# EAGLE design Qwiic Power Switch (EAGLE 9.6.0)
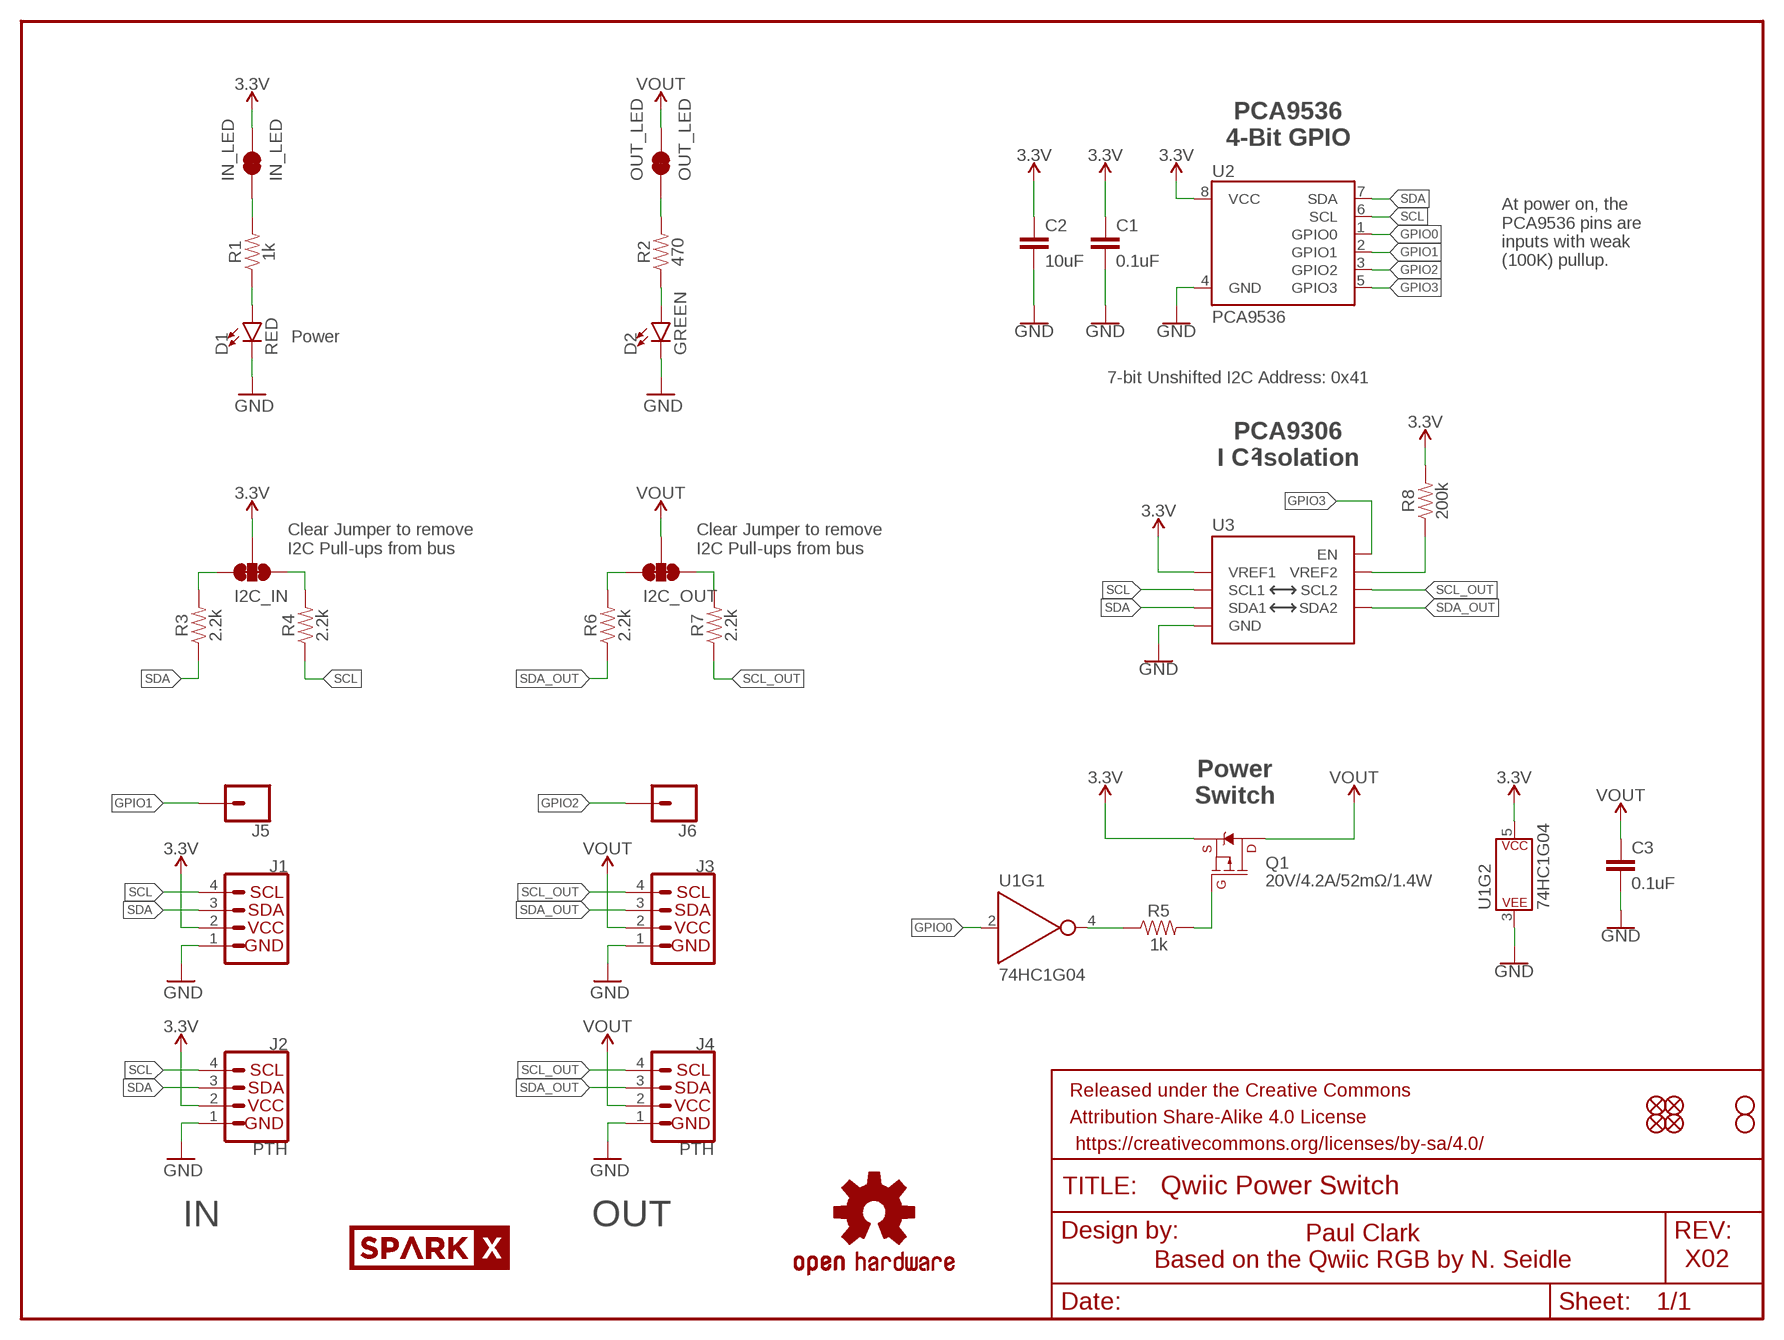
[diagram p0: schematic, sheet 1]

## Parts
C1  0.1uF  0.1UF-0603-25V-(+80/-20%)  [0603]
C2  10uF  10UF-0603-6.3V-20%  [0603]
C3  0.1uF  0.1UF-0603-25V-(+80/-20%)  [0603]
D1  RED  LED-RED0603  [LED-0603]
D2  GREEN  LED-GREEN0603  [LED-0603]
FRAME1  FRAME-LETTER  [CREATIVE_COMMONS]
I2C_IN  JUMPER-SMT_3_2-NC_TRACE_SILK  [SMT-JUMPER_3_2-NC_TRACE_SILK]
I2C_OUT  JUMPER-SMT_3_2-NC_TRACE_SILK  [SMT-JUMPER_3_2-NC_TRACE_SILK]
IN_LED  IN_LED  JUMPER-SMT_2_NC_TRACE_SILK  [SMT-JUMPER_2_NC_TRACE_SILK]
J1  Qwiic Right Angle  I2C_STANDARDQWIIC  [JST04_1MM_RA]
J2  PTH  I2C_STANDARD_NO_SILK  [1X04_NO_SILK]
J3  Qwiic Right Angle  I2C_STANDARDQWIIC  [JST04_1MM_RA]
J4  PTH  I2C_STANDARD_NO_SILK  [1X04_NO_SILK]
J5  CONN_01PTH_NO_SILK_YES_STOP  [1X01_NO_SILK]
J6  CONN_01PTH_NO_SILK_YES_STOP  [1X01_NO_SILK]
JP1  FIDUCIAL1X2  [FIDUCIAL-1X2]
JP2  FIDUCIAL1X2  [FIDUCIAL-1X2]
JP3  STAND-OFF  [STAND-OFF]
JP4  STAND-OFF  [STAND-OFF]
JP5  FIDUCIAL1X2  [FIDUCIAL-1X2]
JP6  FIDUCIAL1X2  [FIDUCIAL-1X2]
LOGO1  OSHW-LOGOMINI  [OSHW-LOGO-MINI]
OUT_LED  OUT_LED  JUMPER-SMT_2_NC_TRACE_SILK  [SMT-JUMPER_2_NC_TRACE_SILK]
Q1  20V/4.2A/52mΩ/1.4W  MOSFET_PCH-DMG2305UX-7  [SOT23-3]
R1  1k  1KOHM-0603-1/10W-1%  [0603]
R2  470  470OHM-0603-1/10W-1%  [0603]
R3  2.2k  2.2KOHM-0603-1/10W-1%  [0603]
R4  2.2k  2.2KOHM-0603-1/10W-1%  [0603]
R5  1k  1KOHM-0603-1/10W-1%  [0603]
R6  2.2k  2.2KOHM-0603-1/10W-1%  [0603]
R7  2.2k  2.2KOHM-0603-1/10W-1%  [0603]
R8  200k  200KOHM-0603-1/10W-1%  [0603]
U1  74HC1G04  [SOT353]
U2  PCA9536  [MSOP8]
U3  PCA9306VSSOP_8PIN  [VSSOP_8PIN]
U$2  SPARKX-LOGO4  [SPARKX-MEDIUM]

## Nets
3.3V: C1.1 C2.1 I2C_IN.2 IN_LED.2 J1.2 J2.2 Q1.2(S) R8.2 U1.5(P$V+) U2.8(VCC) U3.P2(VREF1)
GND: C1.2 C2.2 C3.2 D1.C D2.C J1.1 J2.1 J3.1 J4.1 U1.3(P$V-) U2.4(GND) U3.P1(GND)
GPIO0: U1.2(A) U2.1(GPIO0)
GPIO1: J5.1 U2.2(GPIO1)
GPIO2: J6.1 U2.3(GPIO2)
GPIO3: U2.5(GPIO3) U3.P8(EN)
N$1: I2C_IN.1 R4.2
N$2: I2C_IN.3 R3.2
N$3: D1.A R1.1
N$4: IN_LED.1 R1.2
N$5: R5.1 U1.4(Y)
N$6: Q1.1(G) R5.2
N$7: OUT_LED.1 R2.2
N$8: I2C_OUT.1 R7.2
N$9: D2.A R2.1
N$10: I2C_OUT.3 R6.2
N$12: R8.1 U3.P7(VREF2)
SCL: J1.4 J2.4 R4.1 U2.6(SCL) U3.P3(SCL1)
SCL_OUT: J3.4 J4.4 R7.1 U3.P6(SCL2)
SDA: J1.3 J2.3 R3.1 U2.7(SDA) U3.P4(SDA1)
SDA_OUT: J3.3 J4.3 R6.1 U3.P5(SDA2)
VOUT: C3.1 I2C_OUT.2 J3.2 J4.2 OUT_LED.2 Q1.3(D)

## Notes on the sheet
- PCA9536
  4-Bit GPIO
- At power on, the
  PCA9536 pins are
  inputs with weak
  (100K) pullup.
- Power
- 7-bit Unshifted I2C Address: 0x41
- PCA9306
  I C Isolation
- 2
- Clear Jumper to remove
  I2C Pull-ups from bus
- Clear Jumper to remove
  I2C Pull-ups from bus
- Power
  Switch
- IN | OUT
- Paul Clark
  Based on the Qwiic RGB by N. Seidle
- X02

## Library data of the parts
C1 C3 = SparkFun-Capacitors:0.1UF: 0.1µF ceramic capacitors A capacitor is a passive two-terminal electrical component used to store electrical energy temporarily in an electric field.; PROD_ID: CAP-00810
C2 = SparkFun-Capacitors:10UF: 10.0µF ceramic capacitors A capacitor is a passive two-terminal electrical component used to store electrical energy temporarily in an electric field.; PROD_ID: CAP-11015
D1 = SparkFun-LED:LED-RED: Red SMD LED Used in manufacturing of most products at SparkFun Packages: 0603 - SMD 0603 package [Product Link] <http://docs.avagotech.com/docs/AV02-0551EN> 0603 SMART - SMD 0603 SMART package ( more efficient and expensive)[Product Link] <http://www.osram-os.com/Graphics/XPic2/00077099_0.pdf> 1206 - SMD1206 package [Product Link] <https://www.sparkfun.com/datasheets/DevTools/LilyPad/Q150OVS4.pdff> SparkFun Products: Pro Mini 328 -5V <https://www.sparkfun.com/products/821> RedBoard <https://www.sparkfun.com/products/12757> IOIO-OTG <https://www.sparkfun.com/products/13613>; PROD_ID: DIO-00819
D2 = SparkFun-LED:LED-GREEN: Green SMD LED Used in manufacturing of various products at SparkFun Packages: 0603 - SMD 0603 package [Product Link] <http://www.futureelectronics.com/en/technologies/semiconductors/optoelectronics/leds/Pages/9894312-LTST-C190GKT.aspx?CrossPart=HSMG-C190&IM=0> LilyPad 1206 - SMD1206 LilyPad package [Product Link] <http://www.futureelectronics.com/en/Technologies/Product.aspx?ProductID=IN150NGHARVATEKCORPORATION2049943&IM=0> 1206 - SMD1206 package [Product Link] <http://www.futureelectronics.com/en/technologies/semiconductors/optoelectronics/leds/Pages/8315665-LTST-C150KGKT.aspx?IM=0> 1206 Bottom Mount -SMD 1206 Bottom Mount [Product Link] <http://www.digikey.com/product-detail/en/lite-on-inc/LTST-C230KGKT/160-1456-1-ND/386854> SparkFun Products: Pro Mini 328 -5V <https://www.sparkfun.com/products/821> RedBoard <https://www.sparkfun.com/products/12757> MP3 Trigger <https://www.sparkfun.com/products/13720> Makey Makey <https://www.sparkfun.com/products/11076>; PROD_ID: DIO-00821
FRAME1 = SparkFun-Aesthetics:FRAME-LETTER: Schematic Frame - Letter Standard 8.5x11 US Letter frame
I2C_IN I2C_OUT = SparkFun-Jumpers:JUMPER-SMT_3_2-NC_TRACE: Normally closed trace jumper (2 of 2 connections) This jumper has a trace between all three pads so they are normally closed (NC). Use a razor knife to open the connection(s). For best results follow the IPC guidelines for cutting traces: Cutout at least 0.063 mm (0.005 in). Remove all loose material to clean up the cut area. Seal the cut with an approved epoxy. Reapply solder to reclose the connection(s).
IN_LED OUT_LED = SparkFun-Jumpers:JUMPER-SMT_2_NC_TRACE: Normally closed trace jumper This jumper has a trace between two pads so it's normally closed (NC). Use a razor knife to open the connection. For best results follow the IPC guidelines for cutting traces: Cutout at least 0.063 mm (0.005 in). Remove all loose material to clean up the cut area. Seal the cut with an approved epoxy. Reapply solder to reclose the connection.
J1 J3 = SparkFun-Connectors:I2C_STANDARD: SparkFun I2C Standard Pinout Header SparkFun has standardized on a pinout for all I2C based sensor breakouts. This pinout allows I2C boards to be plugged directly into the headers on Arduino Uno compatible boards, and to be daisy chained easily. Example SparkFun Products: SparkFun Atmospheric Sensor Breakout - BME280 <https://www.sparkfun.com/products/13676> SparkFun Altitude/Pressure Sensor Breakout - MPL3115A2 <https://www.sparkfun.com/products/11084> SparkFun TOF Range Finder Sensor - VL6180 <https://www.sparkfun.com/products/12785>; PROD_ID: CONN-13694
J2 J4 = SparkFun-Connectors:I2C_STANDARD: SparkFun I2C Standard Pinout Header SparkFun has standardized on a pinout for all I2C based sensor breakouts. This pinout allows I2C boards to be plugged directly into the headers on Arduino Uno compatible boards, and to be daisy chained easily. Example SparkFun Products: SparkFun Atmospheric Sensor Breakout - BME280 <https://www.sparkfun.com/products/13676> SparkFun Altitude/Pressure Sensor Breakout - MPL3115A2 <https://www.sparkfun.com/products/11084> SparkFun TOF Range Finder Sensor - VL6180 <https://www.sparkfun.com/products/12785>
J5 J6 = SparkFun-Connectors:CONN_01: Single connection point. Often used as Generic Header-pin footprint for 0.1 inch spaced/style header connections On any of the 0.1 inch spaced packages, you can populate with these: Break Away Headers - Straight <https://www.sparkfun.com/products/116> (PRT-00116) Break Away Male Headers - Right Angle <https://www.sparkfun.com/products/553> (PRT-00553) Female Headers <https://www.sparkfun.com/products/115> (PRT-00115) Break Away Headers - Machine Pin <https://www.sparkfun.com/products/117> (PRT-00117) Break Away Female Headers - Swiss Machine Pin <https://www.sparkfun.com/products/743> (PRT-00743) This device is also useful as a general connection point to wire up your design to another part of your project. Our various solder wires solder well into these plated through hole pads. Hook-Up Wire - Assortment (Stranded, 22 AWG) <https://www.sparkfun.com/products/11375> (PRT-11375) Hook-Up Wire - Assortment (Solid Core, 22 AWG) <https://www.sparkfun.com/products/11367> (PRT-11367) View the entire wire category on our website here <https://www.sparkfun.com/categories/141> Special notes: SMTSO-256-ET is a "flush mount" nut for a 4-40 screw. We mostly use this on specialty testbeds; it is a nice way to connect hardware to your PCB at an adjustable hieght. Also note, the SNAP packages are for using a snappable style connector. We sell a baggie of snaps and they are also used on two LilyPad designs: Snap Assortment - 30 pack (male and female) <https://www.sparkfun.com/products/11347> (DEV-11347) LilyPad Arduino SimpleSnap <https://www.sparkfun.com/products/10941> (DEV-10941) LilyPad SimpleSnap Protoboard <https://www.sparkfun.com/products/10940> (DEV-10940)
JP1 JP2 JP5 JP6 = SparkFun-Aesthetics:FIDUCIAL: Fiducial Alignment Points Point-of-reference for pick-and-place machines and other optical instruments.
JP3 JP4 = SparkFun-Hardware:STAND-OFF: Stand Off Drill holes for mechanically mounting via screws, standoffs, etc. Note: Use the keepout ring to avoid running the screw head into surrounding components. Variant Overviews STAND-OFF - Mechanical footprint for a #4 phillips button head screw. STAND-OFF-TIGHT - Mechanical footprint for a #4 phillips button head screw, Example SparkFun Products Screw - Phillips Head (1/4", 4-40, 10 pack) <https://www.sparkfun.com/products/10453> (PRT-10453) Screw - Phillips Head (1/2", 4-40, 10 pack) <https://www.sparkfun.com/products/10452> (PRT-10452) Screw - Phillips Head (3/4", 4-40, 10 pack) <https://www.sparkfun.com/products/10451> (PRT-10451) Screw - Phillips Head (1", 4-40, 10 pack) <https://www.sparkfun.com/products/10450> (PRT-10450)
LOGO1 = SparkFun-Aesthetics:OSHW-LOGO: Open-Source Hardware (OSHW) Logo This logo indicates the piece of hardware it is found on incorporates a OSHW license and/or adheres to the definition of open source hardware found here: http://freedomdefined.org/OSHW
Q1 = SparkFun-DiscreteSemi:MOSFET_PCH: P-channel MOSFETs Voltage controlled devices that allow control of high current outputs. SparkFun Products: SparkFun ESP32 Thing <https://www.sparkfun.com/products/13907> SparkFun ESP8266 Thing <https://www.sparkfun.com/products/13231> SparkFun Pi Servo HAT V2 <https://www.sparkfun.com/products/15316> DMG2305UX-7 (20V/4.2A/SOT23-3); PROD_ID: TRAN-14388
R1 R5 = SparkFun-Resistors:1KOHM: 1kΩ resistor A resistor is a passive two-terminal electrical component that implements electrical resistance as a circuit element. Resistors act to reduce current flow, and, at the same time, act to lower voltage levels within circuits. - Wikipedia; PROD_ID: RES-07856
R2 = SparkFun-Resistors:470OHM: 470Ω resistor A resistor is a passive two-terminal electrical component that implements electrical resistance as a circuit element. Resistors act to reduce current flow, and, at the same time, act to lower voltage levels within circuits. - Wikipedia; PROD_ID: RES-07869
R3 R4 R6 R7 = SparkFun-Resistors:2.2KOHM: 2.2kΩ resistor A resistor is a passive two-terminal electrical component that implements electrical resistance as a circuit element. Resistors act to reduce current flow, and, at the same time, act to lower voltage levels within circuits. - Wikipedia; PROD_ID: RES-08272
R8 = SparkFun-Resistors:200KOHM: 200kΩ resistor A resistor is a passive two-terminal electrical component that implements electrical resistance as a circuit element. Resistors act to reduce current flow, and, at the same time, act to lower voltage levels within circuits. - Wikipedia; PROD_ID: RES-09385
U1 = SparkFun-IC-Logic:74*1G04: Single Inverter IC NOT GATE INVERTER SNGL 1IN SOT353 Supply: 1.65V to 5.5V Datasheet <http://diodes.com/datasheets/74LVC1G04.pdf> SparkFun Products SparkFun Stepoko <https://www.sparkfun.com/products/13899> (ROB-13899) SparkFun CryptoShield <https://www.sparkfun.com/products/13183> (DEV-13183) SparkFun LogicBlocks Kit <https://www.sparkfun.com/products/11006> (KIT-11006) SparkFun ArduMoto <https://www.sparkfun.com/products/9815> (DEV-09815); PROD_ID: COMP-08268
U2 = New_Parts:PCA9536: PCA9536 4-Bit I2C I/O Expander; PROD_ID: IC-15034
U3 = SparkFun-IC-Comms:PCA9306: Bidirectional I2C level shifter Not compatible with all available part number pinout schemes- DOUBLE CHECK!!! Variants PCA9306DC and PSOP-8 are EOL. If your part has VREF as pin 1 then this is your variant. VSSOP_8PIN is not EOL. Datasheet <https://cdn.sparkfun.com/datasheets/BreakoutBoards/PCA9306DC.pdf> SparkFun Products SparkFun Inventor's Kit for RedBot <https://www.sparkfun.com/products/12649> (ROB-12649) SparkFun RedBot Basic Kit <https://www.sparkfun.com/products/13166> (ROB-13166) SparkFun Level Translator Breakout - PCA9306 <https://www.sparkfun.com/products/11955> (BOB-11955) SparkFun Block for Intel Edison - ADC <https://www.sparkfun.com/products/13770> (DEV-13770) SparkFun Block for Intel® Edison - Raspberry Pi B <https://www.sparkfun.com/products/13044> (DEV-13044) SparkFun RedBot Sensor - Accelerometer <https://www.sparkfun.com/products/12589> (SEN-12589); PROD_ID: IC-14450
U$2 = SparkX:SPARKX-LOGO

## Net classes
1 power: width 0.203 mm

## Board
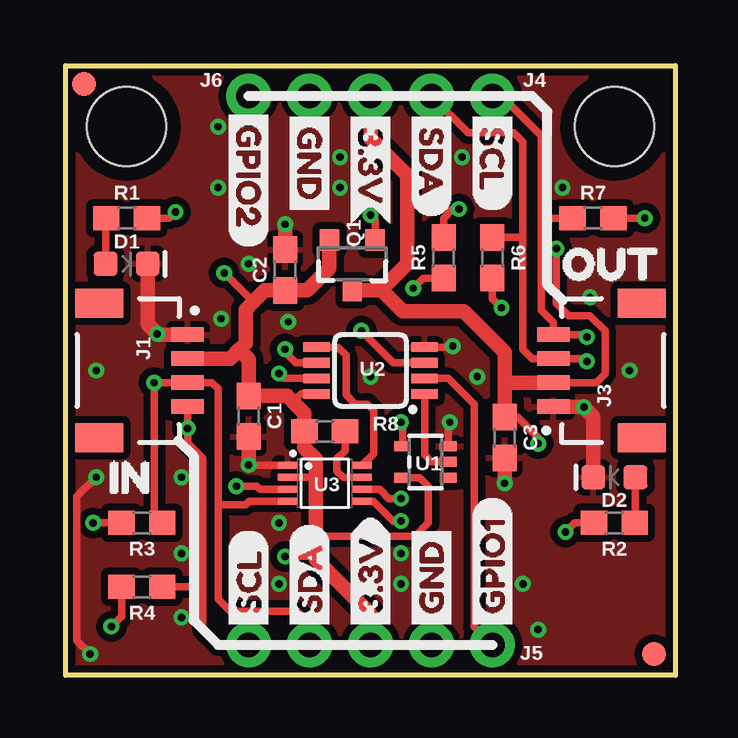
[diagram p1: board, top side]
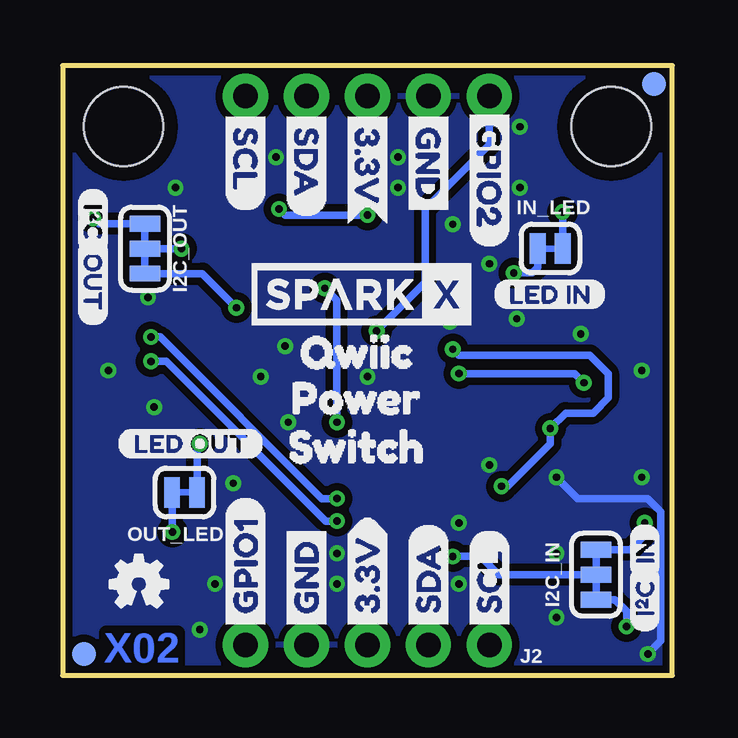
[diagram p2: board, bottom side, seen from below]

Size 25.4 x 25.4 mm. Coordinates in mm from the lower left corner, seen from the top.
Outline: 0,0 0,25.4 25.4,25.4 25.4,0 0,0
Copper layers (1*16): Top 0.035mm / dielectric 1.5mm / Bottom 0.035mm
Design rules "SparkFun-2-layer-PCBWay-LIMIT": minimum track width 6mil, minimum drill 0.3mm, track to track 6mil, track to pad 6mil, pad to pad 6mil, via to via 6mil, smd to smd 6mil, copper to edge 6mil, drill to drill 6mil, minimum pad ring 7mil, minimum via ring 7mil, stop-mask expansion 4mil, vias tented up to drill 25mil, thermal gap 10mil

### Footprints (pad centres in the part's own frame; a part is rotated, then mirrored left to right if it is on the bottom)
0603 = smd 1.1 x 1: 1 -0.85,0; 2 0.85,0
LED-0603 = smd 1 x 1: A -0.877,0; C 0.877,0
SMT-JUMPER_3_2-NC_TRACE_SILK = smd 0.66 x 1.27: 1 -1.041,0; 2 0,0; 3 1.041,0
SMT-JUMPER_2_NC_TRACE_SILK = smd 0.66 x 1.27: 1 -0.521,0; 2 0.521,0
JST04_1MM_RA = smd 0.6 x 1.35: 1 -1.5,0; 2 -0.5,0; 3 0.5,0; 4 1.5,0 | smd 1.2 x 2: NC1 2.8,-3.675; NC2 -2.8,-3.675
1X04_NO_SILK = drill 1.016 pad 1.88: 1 0,0; 2 2.54,0; 3 5.08,0; 4 7.62,0
1X01_NO_SILK = drill 1.016 pad 1.88: 1 0,0
FIDUCIAL-1X2 = smd 1 x 1: 1 0,0
STAND-OFF = hole 3.302: 0,0
SOT23-3 = smd 0.8 x 0.9: 1 -0.95,-1; 2 0.95,-1; 3 0,1.1
SOT353 = smd 0.42 x 0.7: 1 -0.65,-0.95; 2 0,-0.95; 3 0.65,-0.95; 4 0.65,0.95; 5 -0.65,0.95
MSOP8 = smd 1.1 x 0.4: 1 -2.25,0.975; 2 -2.25,0.325; 3 -2.25,-0.325; 4 -2.25,-0.975; 5 2.25,-0.975; 6 2.25,-0.325; 7 2.25,0.325; 8 2.25,0.975
VSSOP_8PIN = smd 0.8 x 0.3: P1 -1.55,0.75; P2 -1.55,0.25; P3 -1.55,-0.25; P4 -1.55,-0.75; P5 1.55,-0.75; P6 1.55,-0.25; P7 1.55,0.25; P8 1.55,0.75

### Placement (x,y rotation side)
C1  7.62,10.79 270 top
C2  9.14,16.89 90 top
C3  18.29,9.91 270 top
D1  2.54,17.14 0 top
D2  22.86,8.26 180 top
FRAME1  -20.32,-17.78 0 top  (outside the outline)
I2C_IN  3.17,4.19 90 bottom
I2C_OUT  21.97,17.78 270 bottom
IN_LED  5.08,17.78 180 bottom
J1  5.08,12.7 270 top
J2  15.24,1.27 0 bottom
J3  20.32,12.7 90 top
J4  10.16,24.13 0 top
J5  17.78,1.27 0 top
J6  7.62,24.13 0 top
JP1  0.76,24.64 0 bottom
JP2  24.51,0.89 0 top
JP3  2.54,22.86 0 top
JP4  22.86,22.86 0 top
JP5  24.51,0.89 0 bottom
JP6  0.76,24.64 0 top
LOGO1  22.23,3.81 0 bottom
OUT_LED  20.32,7.62 0 bottom
Q1  11.94,17.14 180 top
R1  2.54,19.05 0 top
R2  22.86,6.35 180 top
R3  3.17,6.35 180 top
R4  3.17,3.68 180 top
R5  15.75,17.4 90 top
R6  17.78,17.4 270 top
R7  21.97,19.05 0 top
R8  10.79,10.16 180 top
U1  14.99,8.89 90 top
U2  12.7,12.7 180 top
U3  10.79,8 0 top
U$1  [IN0]  1.14,3.94 90 bottom
U$2  12.95,15.88 0 bottom
U$3  [GND1]  10.16,23.75 270 top
U$4  [3#3V0]  12.7,1.65 90 bottom
U$5  [SDA8]  15.24,23.75 270 top
U$6  [SCL9]  17.78,23.75 270 top
U$7  [3#3V0]  12.7,23.75 270 bottom
U$8  [GND1]  15.24,1.65 90 bottom
U$9  [SCL9]  7.62,1.65 90 bottom
U$10  [I_SUPER2_C-()-03]  1.14,1.78 90 bottom
U$11  [SDA8]  10.16,1.65 90 bottom
U$12  [3#3V0]  12.7,23.75 270 top
U$13  [GND1]  15.24,1.65 90 top
U$14  [OUT0]  24.13,18.29 270 bottom
U$15  [SDA8]  10.16,1.65 90 top
U$16  [GPIO10]  17.78,1.65 90 bottom
U$17  [SCL9]  7.62,1.65 90 top
U$18  [I_SUPER2_C-()-03]  24.13,20.32 270 bottom
U$19  [QWIIC0]  16.64,13.46 0 bottom
U$20  [GPIO20]  7.62,23.88 270 bottom
U$22  [GND1]  10.16,23.75 270 bottom
U$23  [3#3V0]  12.7,1.65 90 top
U$24  [GPIO10]  17.78,1.65 90 top
U$25  [GPIO20]  7.62,23.88 270 top
U$26  [SCL9]  17.78,23.75 270 bottom
U$27  [SDA8]  15.24,23.75 270 bottom
U$28  [IN0]  0.64,8.26 0 top
U$29  [LED_IN0]  7.49,15.88 0 bottom
U$30  [LED_OUT0]  23.11,9.65 0 bottom
U$31  [OUT0]  19.56,17.14 0 top
U$32  [POWER0]  17.02,11.56 0 bottom
U$34  [SWITCH0]  17.14,9.53 0 bottom

### Tracks (layer width: path | path; a pad name or v marks a point on that pad's centre or on a via)
3.3V  (via drill 0.3)
  Top 0.305: 7.24,13.55 7.24,13.59 | U2.8 9.82,11.72 9.48,11.39 | v6.6,16.76 7.81,15.56 | U1.5 14.75,8.24 15.11,7.87 15.11,6.35 14.55,5.79 10.49,5.79 10.41,5.71 | v9.14,4.95 10.29,4.95 10.41,4.83 | U3.P2 10.41,8.25 10.41,8.26
  Top 0.61: J1.2 6.85,13.2 7.24,13.59 7.49,13.84 7.49,15.24 7.81,15.56 8.29,16.04 C2.1 10.07,16.04 10.99,16.96 Q1.2 | 7.24,13.55 7.62,13.17 C1.1 9.22,11.64 9.48,11.39 9.95,10.92 R8.2 9.95,9.49 10.41,9.02 10.41,8.26 10.41,5.71 10.41,4.83 12.7,2.54 J2.2
  Bottom 0.305: IN_LED.2 5.6,17 5.84,16.76 v6.6,16.76 | I2C_IN.2 7.24,4.19 8,4.95 v9.14,4.95
GND  (via drill 0.3)
  Top 0.305: v1.02,0.89 0.47,1.44 0.47,7.46 v1.27,8.26 | v16,10.54 15.94,10.47 U1.3 | U2.4 16.09,13.68 v16.13,13.72 | v7.62,8.76 7.65,8.73 7.66,8.75 U3.P1
  Top 0.61: J1.1 3.83,14.2 v3.81,14.22 3.42,14.62 D1.C | J3.1 21.57,11.2 v21.59,11.18 21.98,10.78 D2.C | C1.2 v7.62,8.76 | C3.2 v18.29,8 | v9.14,18.8 C2.2
  Bottom 0.305: v1.02,0.89 0.47,1.44 0.47,6.82 1.02,7.37 3.94,7.37 v4.83,8.26
  other vias: 21.84,15.75 8.89,3.81 4.83,5.08 19.68,1.91 13.97,3.81 13.97,5.08 23.5,12.7 11.43,21.59 16.51,21.59 6.35,22.86 6.35,20.32 4.83,2.41 9.27,14.73 17.14,12.45 8.89,6.35 7.62,17.14 20.7,20.32 19.05,3.81 1.27,12.7 11.43,20.32 12.7,12.45 6.48,14.86
  pour Bottom (isolate 0.305): 0,0 0,25.4 25.4,25.4 25.4,0
  pour Top (isolate 0.305): 0,0 0,25.4 25.4,25.4 25.4,0
GPIO0
  Top 0.305: U1.2 15.24,8.89 14.95,9.18 U2.1
GPIO1
  Top 0.305: U2.2 15.95,12.38 17.02,11.3 17.02,2.03 J5.1
GPIO2  (via drill 0.3)
  Top 0.305: U2.3 13.64,13.03 v12.32,14.35
  Bottom 0.305: v12.32,14.35 10.29,16.38 10.29,19.43 7.62,22.1 J6.1
GPIO3
  Top 0.305: U2.5 11.34,13.68 11.68,13.34 11.68,11.68 12.06,11.3 12.57,11.3 12.83,11.05 12.83,9.23 U3.P8
N$1  (via drill 0.3)
  Top 0.305: R4.2 2.33,2.45 v1.91,2.03
  Bottom 0.305: v1.91,2.03 1.91,2.67 2.39,3.15 I2C_IN.1
N$2  (via drill 0.3)
  Top 0.305: R3.2 v1.14,6.35
  Bottom 0.305: v1.14,6.35 1.14,5.84 1.75,5.23 I2C_IN.3
N$3
  Top 0.305: D1.A 1.66,19.02 R1.1
N$4  (via drill 0.3)
  Top 0.305: R1.2 4.32,19.05 v4.57,19.3
  Bottom 0.305: v4.57,19.3 4.57,17.79 IN_LED.1
N$5  (via drill 0.3)
  Top 0.305: U1.4 14.04,10.47 v13.97,10.54 | v14.48,16.13 14.9,16.55 R5.1
  Bottom 0.305: v13.97,10.54 13.97,15.62 v14.48,16.13
N$6  (via drill 0.3)
  Top 0.305: Q1.1 12.89,18.99 v12.7,19.18 | v16.38,19.43 16.13,19.43 15.75,19.05 R5.2
  Bottom 0.305: v12.7,19.18 16.13,19.18 v16.38,19.43
N$7  (via drill 0.3)
  Top 0.305: R2.2 21.21,6.35 v20.83,5.97
  Bottom 0.305: v20.83,5.97 20.83,7.61 OUT_LED.1
N$8  (via drill 0.3)
  Top 0.305: R7.2 v24.13,19.05
  Bottom 0.305: I2C_OUT.1 23.9,18.82 v24.13,19.05
N$9
  Top 0.305: D2.A 23.74,6.38 R2.1
N$10  (via drill 0.3)
  Top 0.305: R6.2 17.78,15.7 v18.16,15.32
  Bottom 0.305: I2C_OUT.3 19.58,16.74 v18.16,15.32
N$12
  Top 0.305: R8.1 11.64,9.36 11.3,9.02 11.3,8.51 11.56,8.25 U3.P7
SCL  (via drill 0.3)
  Top 0.305: 5.71,3.68 5.71,9.04 5.08,9.68 v5.08,10.29 J1.4 | 5.71,3.68 5.71,1.91 6.35,1.27 J2.4 | R4.1 5.71,3.68 | U2.6 9.58,13.03 9.14,13.46 v9.14,13.59 | v7.11,7.87 7.97,7.87 8.09,7.75 U3.P3
  Bottom 0.305: v9.14,13.59 8.89,13.34 3.43,13.34 2.67,12.57 2.67,11.56 3.3,10.92 4.45,10.92 v5.08,10.29 5.08,9.65 6.86,7.87 v7.11,7.87
SCL_OUT  (via drill 0.3)
  Top 0.305: J4.4 18.16,24.13 19.81,22.48 19.81,19.05 | 19.81,19.05 19.81,15.22 20.32,14.71 J3.4 21.61,14.2 v21.72,14.1 | R7.1 19.81,19.05 | v13.97,7.37 13.46,7.37 13.08,7.75 U3.P6
  Bottom 0.305: v13.97,7.37 14.61,7.37 21.34,14.1 v21.72,14.1
SDA  (via drill 0.3)
  Top 0.305: 6.35,7.11 6.35,11.94 6.09,12.2 J1.3 v3.68,12.19 3.68,6.69 R3.1 | 6.35,7.11 6.35,3.17 6.86,2.67 9.65,2.67 10.16,2.16 J2.3 | U2.7 9.09,12.38 v8.89,12.57 | U3.P4 7.64,7.25 7.5,7.11 6.35,7.11
  Bottom 0.305: v3.68,12.19 4.06,12.57 v8.89,12.57
SDA_OUT  (via drill 0.3)
  Top 0.305: J4.3 16.76,22.61 18.67,22.61 19.05,22.23 19.05,18.16 | 19.05,18.16 19.05,13.59 19.44,13.2 J3.3 21.6,13.2 v21.72,13.08 | R6.1 18.96,18.25 19.05,18.16 | v13.97,6.43 13.64,6.43 12.81,7.25 U3.P5
  Bottom 0.305: v13.97,6.43 14.43,6.43 21.08,13.08 v21.72,13.08
VOUT  (via drill 0.3)
  Top 0.305: v19.68,9.65 19.68,9.91 18.84,10.76 C3.1 | J3.2 22.11,12.2 22.48,12.57 22.48,14.35 21.84,14.99 20.95,14.99 20.45,15.49 v20.45,17.78
  Top 0.61: Q1.3 13.16,16.05 13.65,15.55 | J4.2 12.7,22.35 14.22,20.83 14.22,17.14 13.14,16.06 13.65,15.55 | 18.29,12.19 18.29,13.46 16.59,15.16 14.04,15.16 13.65,15.55 | 18.29,12.19 C3.1 | J3.2 18.3,12.2 18.29,12.19
  Bottom 0.305: OUT_LED.2 19.8,9.54 v19.68,9.65 | v20.45,17.78 I2C_OUT.2

### Text on the board
Bottom: X02